# EAGLE design usb_power_cycler (EAGLE 8.5.1)
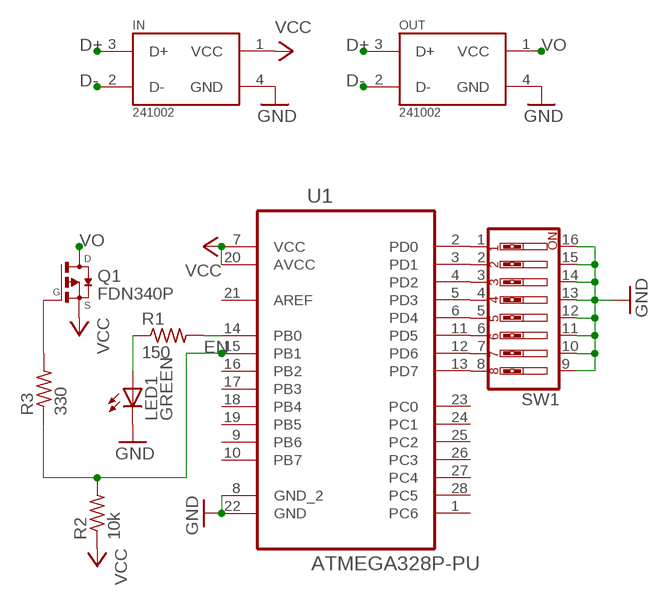
[diagram p0: schematic, sheet 1]

## Parts
IN  241002  [LUMBERG_2410_02]
LED1  GREEN  LEDCHIPLED_0805  [CHIPLED_0805]
OUT  241002  [LUMBERG_2410_02]
Q1  FDN340P  [SSOT-3]
R1  150  R-US_R0805  [R0805]
R2  10k  R-US_R0805  [R0805]
R3  330  R-US_R0805  [R0805]
SW1  SW_DIP-8  [EDG-08]
U1  ATMEGA328P-PU  [DIP254P762X457-28]

## Nets
D+: IN.3(D+) OUT.3(D+)
D-: IN.2(D-) OUT.2(D-)
EN: R2.2 R3.1 U1.15(PB1)
GND: IN.4(GND) LED1.C OUT.4(GND) SW1.9 SW1.10 SW1.11 SW1.12 SW1.13 SW1.14 SW1.15 SW1.16 U1.8(GND_2) U1.22(GND)
N$1: LED1.A R1.1
N$2: SW1.1 U1.2(PD0)
N$3: SW1.2 U1.3(PD1)
N$4: SW1.3 U1.4(PD2)
N$5: SW1.4 U1.5(PD3)
N$6: SW1.5 U1.6(PD4)
N$7: SW1.6 U1.11(PD5)
N$8: SW1.7 U1.12(PD6)
N$9: SW1.8 U1.13(PD7)
N$10: R1.2 U1.14(PB0)
N$12: Q1.1(G) R3.2
VCC: IN.1(VCC) Q1.2(S) R2.1 U1.7(VCC) U1.20(AVCC)
VO: OUT.1(VCC) Q1.3(D)
Unconnected: U1.1(PC6) U1.9(PB6) U1.10(PB7) U1.16(PB2) U1.17(PB3) U1.18(PB4) U1.19(PB5) U1.21(AREF) U1.23(PC0) U1.24(PC1) U1.25(PC2) U1.26(PC3) U1.27(PC4) U1.28(PC5)

## Library data of the parts
IN OUT = 241002:241002: Socket; USB A; on PCBs; THT; PIN: 4; angled 90°; V: USB 2.0; AVAILABILITY: Good; DESCRIPTION: Socket; USB A; on PCBs; THT; PIN: 4; angled 90°; V: USB 2.0; MF: Lumberg; MP: 2410 02; PACKAGE: None; PRICE: 0.73 USD
LED1 = adafruit:LED: LED OSRAM: - CHIPLED LG R971, LG N971, LY N971, LG Q971, LY Q971, LO R971, LY R971 LH N974, LH R974 LS Q976, LO Q976, LY Q976 LO Q996 - Hyper CHIPLED LW Q18S LB Q993, LB Q99A, LB R99A - SideLED LS A670, LO A670, LY A670, LG A670, LP A670 LB A673, LV A673, LT A673, LW A673 LH A674 LY A675 LS A676, LA A676, LO A676, LY A676, LW A676 LS A679, LY A679, LG A679 - Hyper Micro SIDELED® LS Y876, LA Y876, LO Y876, LY Y876 LT Y87S - SmartLED LW L88C, LW L88S LB L89C, LB L89S, LG L890 LS L89K, LO L89K, LY L89K LS L896, LA L896, LO L896, LY L896 - TOPLED LS T670, LO T670, LY T670, LG T670, LP T670 LSG T670, LSP T670, LSY T670, LOP T670, LYG T670 LG T671, LOG T671, LSG T671 LB T673, LV T673, LT T673, LW T673 LH T674 LS T676, LA T676, LO T676, LY T676, LB T676, LH T676, LSB T676, LW T676 LB T67C, LV T67C, LT T67C, LS T67K, LO T67K, LY T67K, LW E67C LS E67B, LA E67B, LO E67B, LY E67B, LB E67C, LV E67C, LT E67C LW T67C LS T679, LY T679, LG T679 LS T770, LO T770, LY T770, LG T770, LP T770 LB T773, LV T773, LT T773, LW T773 LH T774 LS E675, LA E675, LY E675, LS T675 LS T776, LA T776, LO T776, LY T776, LB T776 LHGB T686 LT T68C, LB T68C - Hyper Mini TOPLED® LB M676 - Mini TOPLED Santana® LG M470 LS M47K, LO M47K, LY M47K Source: http://www.osram.convergy.de/
Q1 = FDN340P:FDN340P: P-Channel MOSFET Logic Level, PowerTrench MOSFET; AVAILABILITY: Good; DESCRIPTION: Single P-Channel 20V 70 mOhm Logic Level PowerTrench Mosfet SSOT-3; MF: ON Semiconductor; MP: FDN340P; PACKAGE: SC-59 ON Semiconductor; PRICE: 0.34 USD
R1-R3 = resistor:R-US_: RESISTOR, American symbol
SW1 = special:SW_DIP-8: DIP SWITCH
U1 = Atmel_By_element14_Batch_1-00:ATMEGA328P-PU: 8-bit Microcontroller with In-System Programmable Flash; MPN: ATMEGA328P-PU; OC_FARNELL: 1715487; OC_NEWARK: 15R0268; PACKAGE: PDIP-28; SUPPLIER: Atmel

## Net classes
0 default: width 0.152 mm, drill 0.3 mm, clearance 0.152 mm

## Board
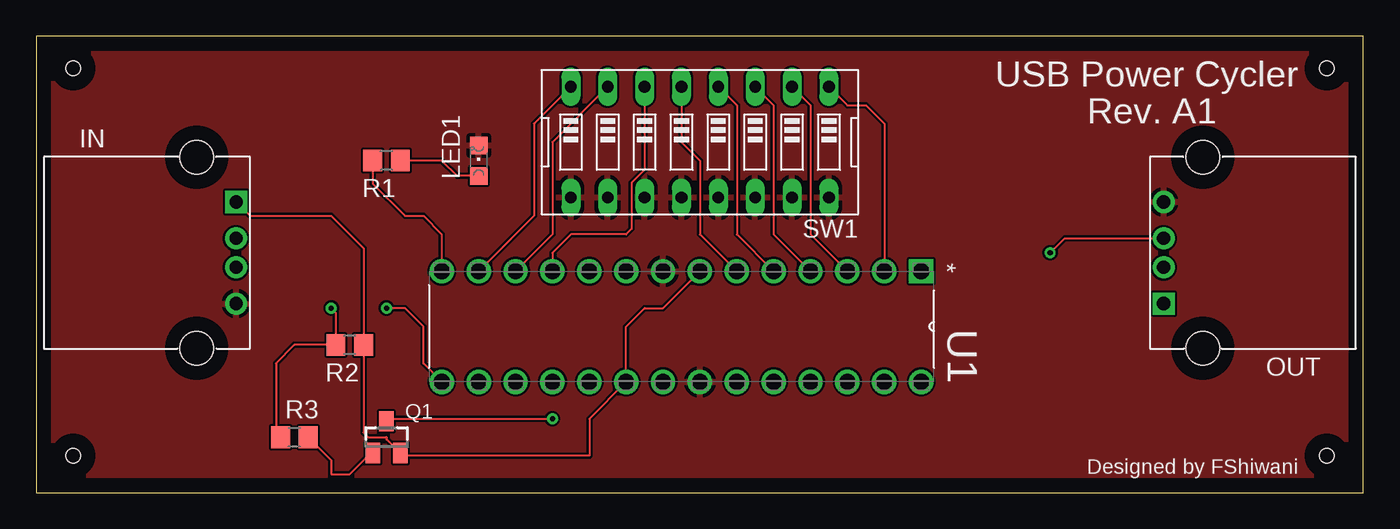
[diagram p1: board, top side]
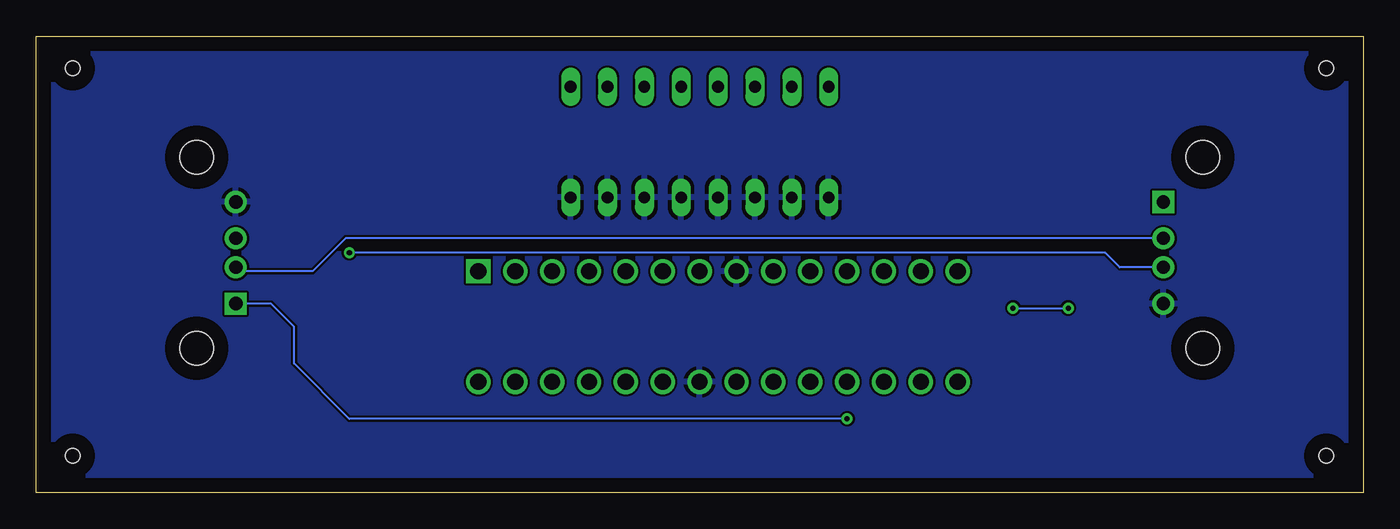
[diagram p2: board, bottom side, seen from below]

Size 91.42 x 31.42 mm. Coordinates in mm from the lower left corner, seen from the top.
Outline: 0,0 91.42,0 91.42,31.42 0,31.42 0,0
Copper layers (1*16): Top 0.035mm / dielectric 1.5mm / Bottom 0.035mm
Design rules "default": minimum track width 6mil, minimum drill 0.35mm, track to track 6mil, track to pad 6mil, pad to pad 6mil, via to via 6mil, smd to smd 6mil, copper to edge 40mil, drill to drill 6mil, minimum pad ring 10mil, minimum via ring 8mil, stop-mask expansion 4mil, vias tented up to drill 0mil, thermal gap 10mil
Holes 1 mm at 2.54,2.54 88.9,2.54 88.9,29.21 2.54,29.21

### Footprints (pad centres in the part's own frame; a part is rotated, then mirrored left to right if it is on the bottom)
LUMBERG_2410_02 = drill 0.92 pad 1.52 square: 1 -3.5,6.15 | drill 0.92 pad 1.52: 2 -1,6.15; 3 1,6.15; 4 3.5,6.15 | hole 2.3: -6.57,3.44; 6.57,3.44
CHIPLED_0805 = smd 1.2 x 1.2: A 0,-1.05; C 0,1.05
SSOT-3 = smd 1 x 1.4: 1 -0.95,-1.1; 2 0.95,-1.1; 3 0,1.1
R0805 = smd 1.3 x 1.5: 1 -0.95,0; 2 0.95,0
EDG-08 = drill 0.813 long: 1 -8.89,-3.81; 2 -6.35,-3.81; 3 -3.81,-3.81; 4 -1.27,-3.81; 5 1.27,-3.81; 6 3.81,-3.81; 7 6.35,-3.81; 8 8.89,-3.81; 9 8.89,3.81; 10 6.35,3.81; 11 3.81,3.81; 12 1.27,3.81; 13 -1.27,3.81; 14 -3.81,3.81; 15 -6.35,3.81; 16 -8.89,3.81
DIP254P762X457-28 = drill 1.118 square: 1 -7.62,33.02 | drill 1.118: 2 -7.62,30.48; 3 -7.62,27.94; 4 -7.62,25.4; 5 -7.62,22.86; 6 -7.62,20.32; 7 -7.62,17.78; 8 -7.62,15.24; 9 -7.62,12.7; 10 -7.62,10.16; 11 -7.62,7.62; 12 -7.62,5.08; 13 -7.62,2.54; 14 -7.62,0; 15 0,0; 16 0,2.54; 17 0,5.08; 18 0,7.62; 19 0,10.16; 20 0,12.7; 21 0,15.24; 22 0,17.78; 23 0,20.32; 24 0,22.86; 25 0,25.4; 26 0,27.94; 27 0,30.48; 28 0,33.02

### Placement (x,y rotation side)
IN  7.62,16.51 270 top
LED1  30.48,22.86 0 top
OUT  83.82,16.51 90 top
Q1  24.13,3.81 0 top
R1  24.13,22.86 180 top
R2  21.59,10.16 180 top
R3  17.78,3.81 0 top
SW1  45.72,24.13 180 top
U1  27.94,7.62 270 top

### Tracks (layer width: path | path; a pad name or v marks a point on that pad's centre or on a via)
D+  (via drill 0.35)
  Top 0.152: v69.85,16.51 70.85,17.51 OUT.3
  Bottom 0.152: IN.3 16.78,15.51 17.78,16.51 v69.85,16.51
D-
  Bottom 0.152: IN.2 70.12,17.51 72.39,15.24 77.4,15.24 OUT.2
EN  (via drill 0.35)
  Top 0.152: R3.1 16.51,4.13 16.51,8.89 17.78,10.16 R2.2 20.64,12.38 v20.32,12.7 | U1.15 26.67,8.89 26.67,11.43 25.4,12.7 v24.13,12.7
  Bottom 0.152: v24.13,12.7 v20.32,12.7
GND
  pour Top: 0,31.75 91.44,31.75 91.44,0 0,0
  pour Bottom: 0,31.75 91.44,31.75 91.44,0 0,0
N$1
  Top 0.152: LED1.A 28.99,21.81 27.94,22.86 R1.1
N$2
  Top 0.152: SW1.1 55.88,26.67 57.15,26.67 58.42,25.4 U1.2
N$3
  Top 0.152: SW1.2 53.34,26.67 53.34,17.78 U1.3
N$4
  Top 0.152: SW1.3 50.8,26.67 50.8,17.78 U1.4
N$5
  Top 0.152: SW1.4 48.26,26.67 48.26,17.78 U1.5
N$6
  Top 0.152: SW1.5 44.45,24.13 45.72,22.86 45.72,17.78 U1.6
N$7
  Top 0.152: SW1.6 41.91,22.24 41.02,21.35 41.02,18.16 40.64,17.78 36.83,17.78 35.56,16.51 U1.11
N$8
  Top 0.152: SW1.7 35.56,24.13 35.56,17.78 U1.12
N$9
  Top 0.152: SW1.8 34.29,25.4 34.29,19.05 U1.13
N$10
  Top 0.152: R1.2 23.18,21.27 25.4,19.05 26.67,19.05 27.94,17.78 U1.14
N$12
  Top 0.152: R3.2 20.32,2.22 20.32,1.27 21.59,1.27 22.86,2.54 23.01,2.54 Q1.1
VCC
  Top 0.152: IN.1 14.73,19.05 20.32,19.05 22.54,16.83 R2.1 22.54,4.13 22.86,3.81 24.13,3.81 24.13,3.66 Q1.2 25.25,2.54 38.1,2.54 38.1,5.08 U1.20 40.64,11.43 41.91,12.7 43.18,12.7 U1.7
VO  (via drill 0.35)
  Top 0.152: Q1.3 24.3,5.08 v35.56,5.08
  Bottom 0.152: v35.56,5.08 69.85,5.08 73.66,8.89 73.66,11.43 75.24,13.01 OUT.1

### Text on the board
tPlace: USB Power Cycler | Rev. A1 | Designed by FShiwani